# EAGLE design Arduino1 (EAGLE 6.6.0)
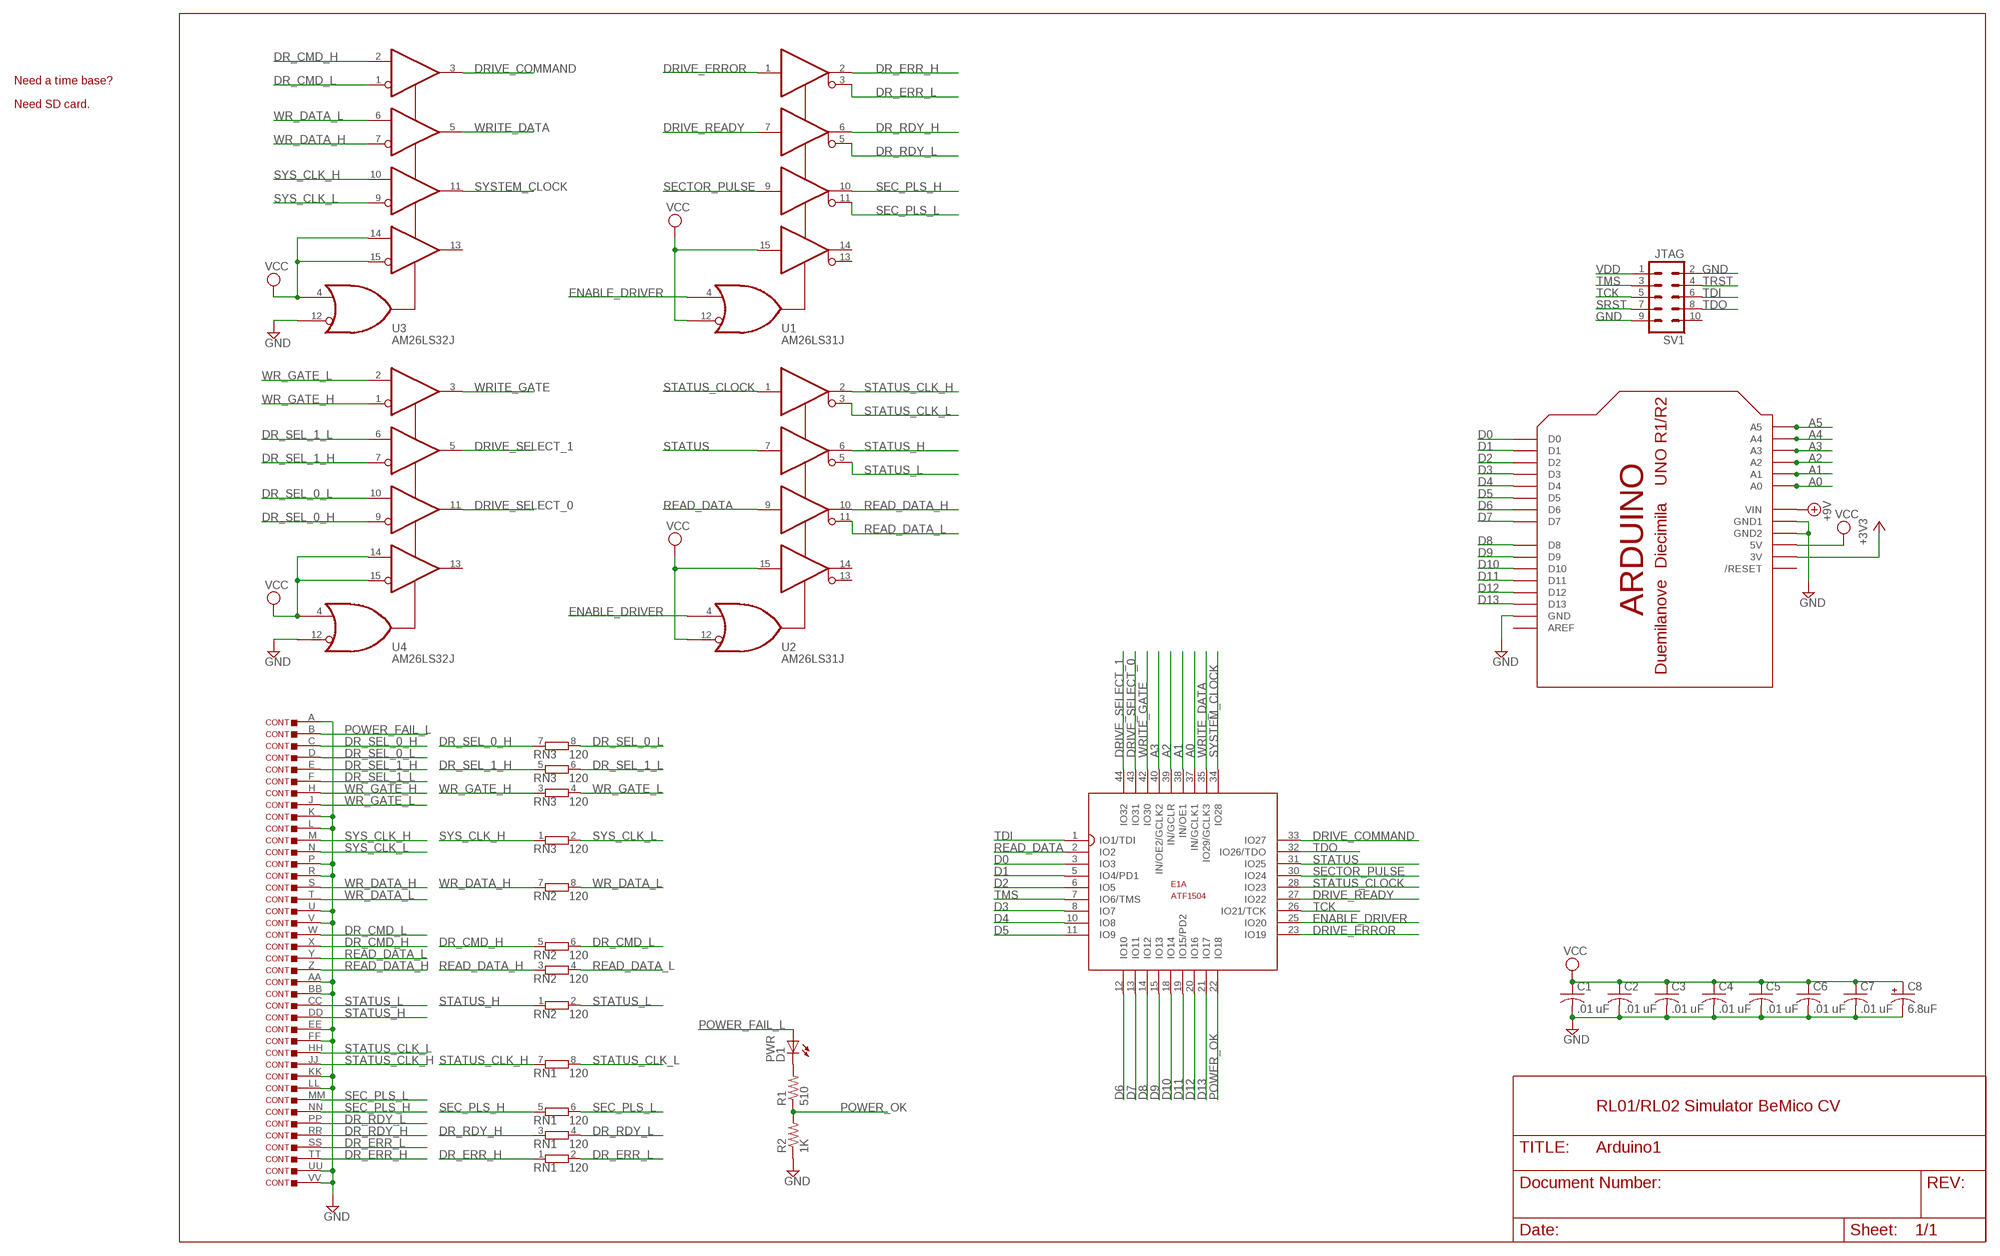
[diagram p0: schematic, sheet 1]

## Parts
C1  .01 uF  C-US050-025X075  [C050-025X075]
C2  .01 uF  C-US050-025X075  [C050-025X075]
C3  .01 uF  C-US050-025X075  [C050-025X075]
C4  .01 uF  C-US050-025X075  [C050-025X075]
C5  .01 uF  C-US050-025X075  [C050-025X075]
C6  .01 uF  C-US050-025X075  [C050-025X075]
C7  .01 uF  C-US050-025X075  [C050-025X075]
C8  6.8uF  CPOL-USE5-5  [E5-5]
CONT  DEC40PINSV  [DEC40PINV]
D1  PWR  LED5MM  [LED5MM]
E1  ATF1504  ATF150X44TQFP  [TQFP44]
R1  510  R-US_0207/10  [0207/10]
R2  1K  R-US_0207/10  [0207/10]
RN1  120  E4RP  [SIL8]
RN2  120  E4RP  [SIL8]
RN3  120  E4RP  [SIL8]
SV1  JTAG  ML10  [ML10]
U1  AM26LS31J  [SO16]
U2  AM26LS31J  [SO16]
U3  AM26LS32J  [SO16]
U4  AM26LS32J  [SO16]
U$3  ARDUINOUNO  [ARDUINO]

## Nets
+3V3: U$3.3V
+9V: U$3.VIN
A0: E1.37(A:IN/GCLK1) U$3.A0
A1: E1.38(A:IN/OE1) U$3.A1
A2: E1.39(A:IN/GCLR) U$3.A2
A3: E1.40(A:IN/OE2/GCLK2) U$3.A3
A4: U$3.A4
A5: U$3.A5
D0: E1.3(A:IO3) U$3.D0
D1: E1.5(A:IO4/PD1) U$3.D1
D2: E1.6(A:IO5) U$3.D2
D3: E1.8(A:IO7) U$3.D3
D4: E1.10(A:IO8) U$3.D4
D5: E1.11(A:IO9) U$3.D5
D6: E1.12(A:IO10) U$3.D6
D7: E1.13(A:IO11) U$3.D7
D8: E1.14(A:IO12) U$3.D8
D9: E1.15(A:IO13) U$3.D9
D10: E1.18(A:IO14) U$3.D10
D11: E1.19(A:IO15/PD2) U$3.D11
D12: E1.20(A:IO16) U$3.D12
D13: E1.21(A:IO17) U$3.D13
DR_CMD_H: CONT.X RN2.5 U3.2(P1)
DR_CMD_L: CONT.W RN2.6 U3.1(N1)
DR_ERR_H: CONT.TT RN1.1 U1.2(Y1)
DR_ERR_L: CONT.SS RN1.2 U1.3(Z1)
DR_RDY_H: CONT.RR RN1.3 U1.6(Y2)
DR_RDY_L: CONT.PP RN1.4 U1.5(Z2)
DR_SEL_0_H: CONT.C RN3.7 U4.9(N3)
DR_SEL_0_L: CONT.D RN3.8 U4.10(P3)
DR_SEL_1_H: CONT.E RN3.5 U4.7(N2)
DR_SEL_1_L: CONT.F RN3.6 U4.6(P2)
DRIVE_COMMAND: E1.33(A:IO27) U3.3(Y1)
DRIVE_ERROR: E1.23(A:IO19) U1.1(A1)
DRIVE_READY: E1.27(A:IO22) U1.7(A2)
DRIVE_SELECT_0: E1.43(A:IO31) U4.11(Y3)
DRIVE_SELECT_1: E1.44(A:IO32) U4.5(Y2)
ENABLE_DRIVER: E1.25(A:IO20) U1.4(G) U2.4(G)
GND [supply]: C1.2 C2.2 C3.2 C4.2 C5.2 C6.2 C7.2 C8.- CONT.A CONT.AA CONT.BB CONT.EE CONT.FF CONT.K CONT.KK CONT.L CONT.LL CONT.P CONT.R CONT.U CONT.UU CONT.V CONT.VV R2.1 SV1.2 SV1.9 U3.12(!G) U4.12(!G) U$3.GND U$3.GND1 U$3.GND2
N$1: D1.K(C) R1.2
N$2: U$3.AREF
N$9: U$3.RESET(/RESET)
POWER_FAIL_L: CONT.B D1.A
POWER_OK: E1.22(A:IO18) R1.1 R2.2
READ_DATA: E1.2(A:IO2) U2.9(A3)
READ_DATA_H: CONT.Z RN2.3 U2.10(Y3)
READ_DATA_L: CONT.Y RN2.4 U2.11(Z3)
SEC_PLS_H: CONT.NN RN1.5 U1.10(Y3)
SEC_PLS_L: CONT.MM RN1.6 U1.11(Z3)
SECTOR_PULSE: E1.30(A:IO24) U1.9(A3)
SRST: SV1.7
STATUS: E1.31(A:IO25) U2.7(A2)
STATUS_CLK_H: CONT.JJ RN1.7 U2.2(Y1)
STATUS_CLK_L: CONT.HH RN1.8 U2.3(Z1)
STATUS_CLOCK: E1.28(A:IO23) U2.1(A1)
STATUS_H: CONT.DD RN2.1 U2.6(Y2)
STATUS_L: CONT.CC RN2.2 U2.5(Z2)
SYS_CLK_H: CONT.M RN3.1 U3.10(P3)
SYS_CLK_L: CONT.N RN3.2 U3.9(N3)
SYSTEM_CLOCK: E1.34(A:IO28) U3.11(Y3)
TCK: E1.26(A:IO21/TCK) SV1.5
TDI: E1.1(A:IO1/TDI) SV1.6
TDO: E1.32(A:IO26/TDO) SV1.8
TMS: E1.7(A:IO6/TMS) SV1.3
TRST: SV1.4
VCC [supply]: C1.1 C2.1 C3.1 C4.1 C5.1 C6.1 C7.1 C8.+ U1.12(!G) U1.15(A4) U2.12(!G) U2.15(A4) U3.4(G) U3.14(P4) U3.15(N4) U4.4(G) U4.14(P4) U4.15(N4) U$3.5V
VDD: SV1.1
WR_DATA_H: CONT.S RN2.7 U3.7(N2)
WR_DATA_L: CONT.T RN2.8 U3.6(P2)
WR_GATE_H: CONT.H RN3.3 U4.1(N1)
WR_GATE_L: CONT.J RN3.4 U4.2(P1)
WRITE_DATA: E1.35(A:IO29/GCLK3) U3.5(Y2)
WRITE_GATE: E1.42(A:IO30) U4.3(Y1)
Unconnected: SV1.10 U1.13(Z4) U1.14(Y4) U2.13(Z4) U2.14(Y4) U3.13(Y4) U4.13(Y4)

## Notes on the sheet
- Need a time base?
- Need SD card.
- RL01/RL02 Simulator BeMico CV

## Power pins joined to a net without a drawn wire
GND: E1.4(GND) E1.16(GND) E1.24(GND) E1.36(GND) U1.8(GND) U2.8(GND) U3.8(GND) U4.8(GND)
VCC: E1.9(VCC) E1.17(VCC) E1.29(VCC) E1.41(VCC) U1.16(VCC) U2.16(VCC) U3.16(VCC) U4.16(VCC)

## Library data of the parts
C1-C7 = rcl:C-US: CAPACITOR, American symbol
C8 = rcl:CPOL-US: POLARIZED CAPACITOR, American symbol
CONT = dec-con:DEC40PINS: 40 pin ribbon connector for BC08, BC11 cables.
D1 = led:LED: LED OSRAM: - CHIPLED LG R971, LG N971, LY N971, LG Q971, LY Q971, LO R971, LY R971 LH N974, LH R974 LS Q976, LO Q976, LY Q976 LO Q996 - Hyper CHIPLED LW Q18S LB Q993, LB Q99A, LB R99A - SideLED LS A670, LO A670, LY A670, LG A670, LP A670 LB A673, LV A673, LT A673, LW A673 LH A674 LY A675 LS A676, LA A676, LO A676, LY A676, LW A676 LS A679, LY A679, LG A679 - Hyper Micro SIDELED® LS Y876, LA Y876, LO Y876, LY Y876 LT Y87S - SmartLED LW L88C, LW L88S LB L89C, LB L89S, LG L890 LS L89K, LO L89K, LY L89K LS L896, LA L896, LO L896, LY L896 - TOPLED LS T670, LO T670, LY T670, LG T670, LP T670 LSG T670, LSP T670, LSY T670, LOP T670, LYG T670 LG T671, LOG T671, LSG T671 LB T673, LV T673, LT T673, LW T673 LH T674 LS T676, LA T676, LO T676, LY T676, LB T676, LH T676, LSB T676, LW T676 LB T67C, LV T67C, LT T67C, LS T67K, LO T67K, LY T67K, LW E67C LS E67B, LA E67B, LO E67B, LY E67B, LB E67C, LV E67C, LT E67C LW T67C LS T679, LY T679, LG T679 LS T770, LO T770, LY T770, LG T770, LP T770 LB T773, LV T773, LT T773, LW T773 LH T774 LS E675, LA E675, LY E675, LS T675 LS T776, LA T776, LO T776, LY T776, LB T776 LHGB T686 LT T68C, LB T68C - Hyper Mini TOPLED® LB M676 - Mini TOPLED Santana® LG M470 LS M47K, LO M47K, LY M47K Source: http://www.osram.convergy.de LUXEON: - LUMILED® LXK2-PW12-R00, LXK2-PW12-S00, LXK2-PW14-U00, LXK2-PW14-V00 LXK2-PM12-R00, LXK2-PM12-S00, LXK2-PM14-U00 LXK2-PE12-Q00, LXK2-PE12-R00, LXK2-PE12-S00, LXK2-PE14-T00, LXK2-PE14-U00 LXK2-PB12-K00, LXK2-PB12-L00, LXK2-PB12-M00, LXK2-PB14-N00, LXK2-PB14-P00, LXK2-PB14-Q00 LXK2-PR12-L00, LXK2-PR12-M00, LXK2-PR14-Q00, LXK2-PR14-R00 LXK2-PD12-Q00, LXK2-PD12-R00, LXK2-PD12-S00 LXK2-PH12-R00, LXK2-PH12-S00 LXK2-PL12-P00, LXK2-PL12-Q00, LXK2-PL12-R00 Source: www.luxeon.com KINGBRIGHT: KA-3528ASYC Source: www.kingbright.com
E1 = atmel-cpld:ATF150X44: ATF150x in 44 pin packages
R1 R2 = rcl:R-US_: RESISTOR, American symbol
RN1-RN3 = resistor-sil:E4RP: SIL RESISTOR; OC_FARNELL: unknown; OC_NEWARK: unknown
SV1 = con-ml:ML10: HARTING; OC_FARNELL: unknown; OC_NEWARK: unknown
U1 U2 = dec-con:AM26LS31: Quad RS-422 Driver
U3 U4 = dec-con:AM26LS32: Quad Differential Reciever
U$3 = arduino:ARDUINO: Arduino Diecimila/Duemilanove Make a shield with ease, this package has all the named pins as well as the two mounting drill holes and an outline of the USB and DC power connector. The outline is on the DIMENSION layer, so if your board house uses it they will cut the outline to match. http://www.ladyada.net/library/pcb/eaglelibrary.html

## Net classes
1 supply: width 0.508 mm

## Board
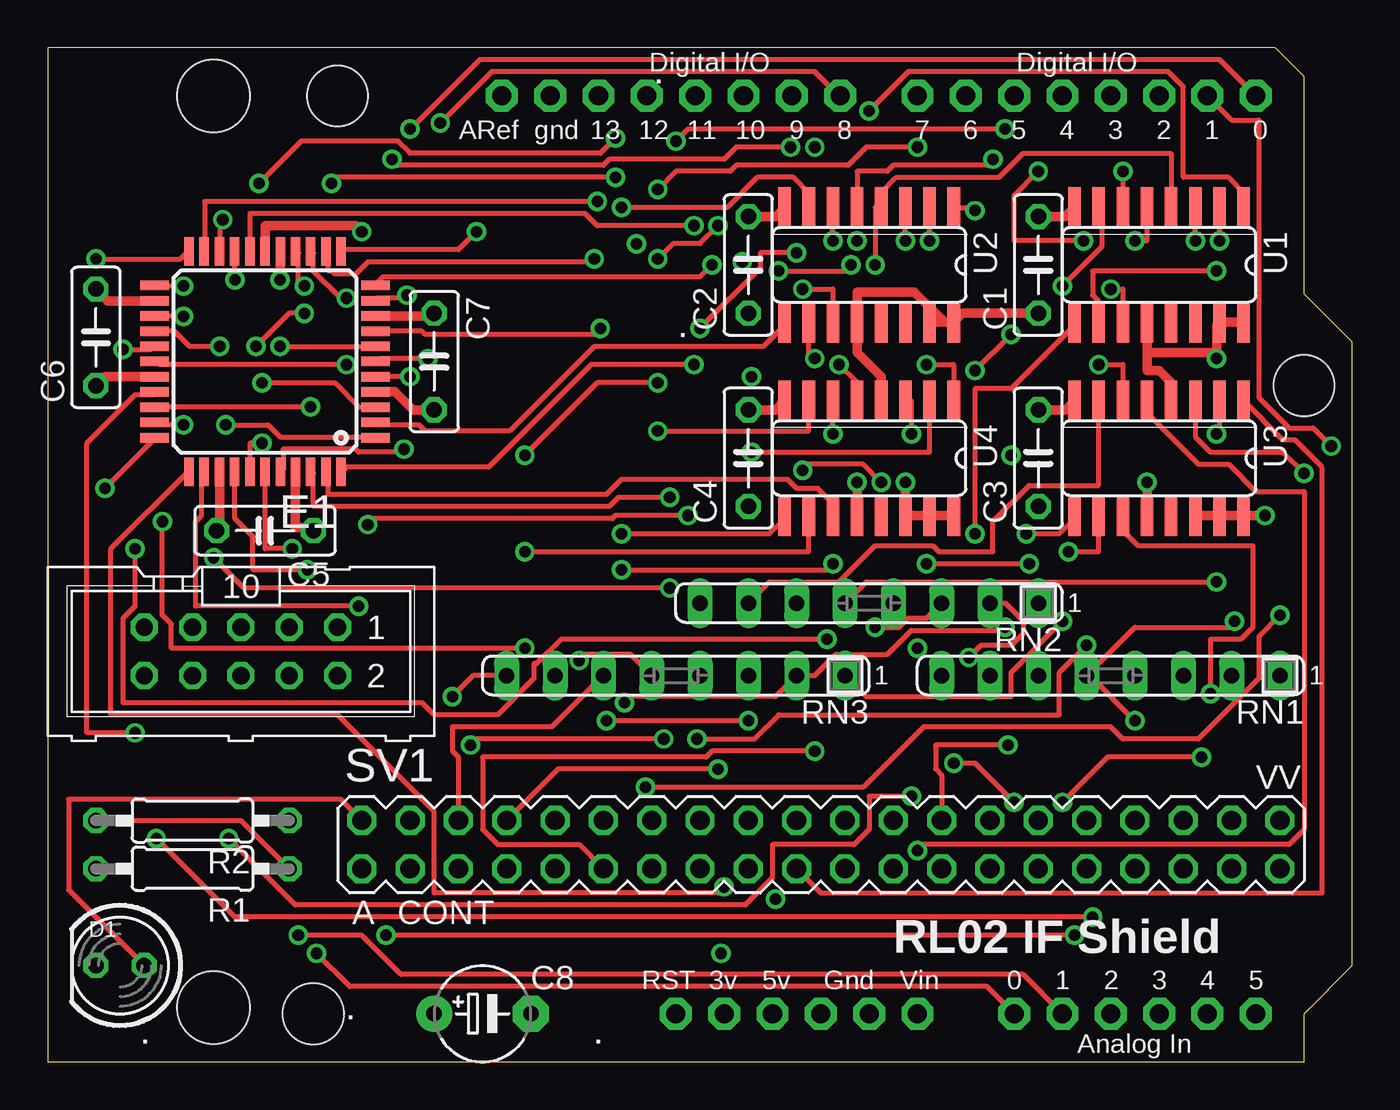
[diagram p1: board, top side]
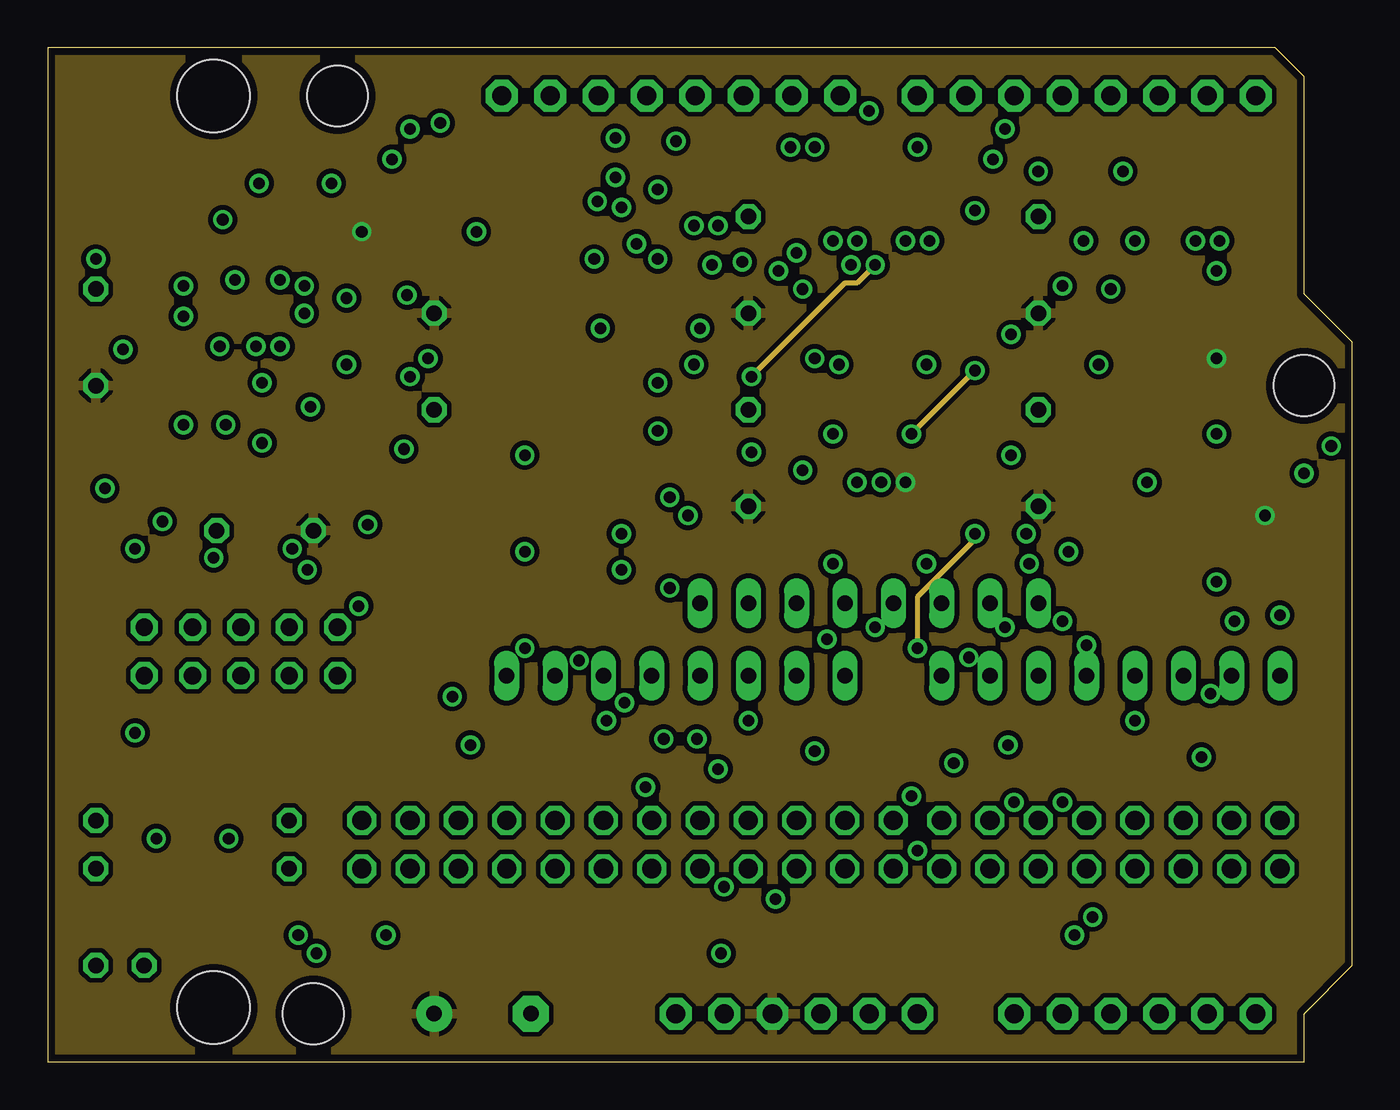
[diagram p2: board, inner layer $VCC]
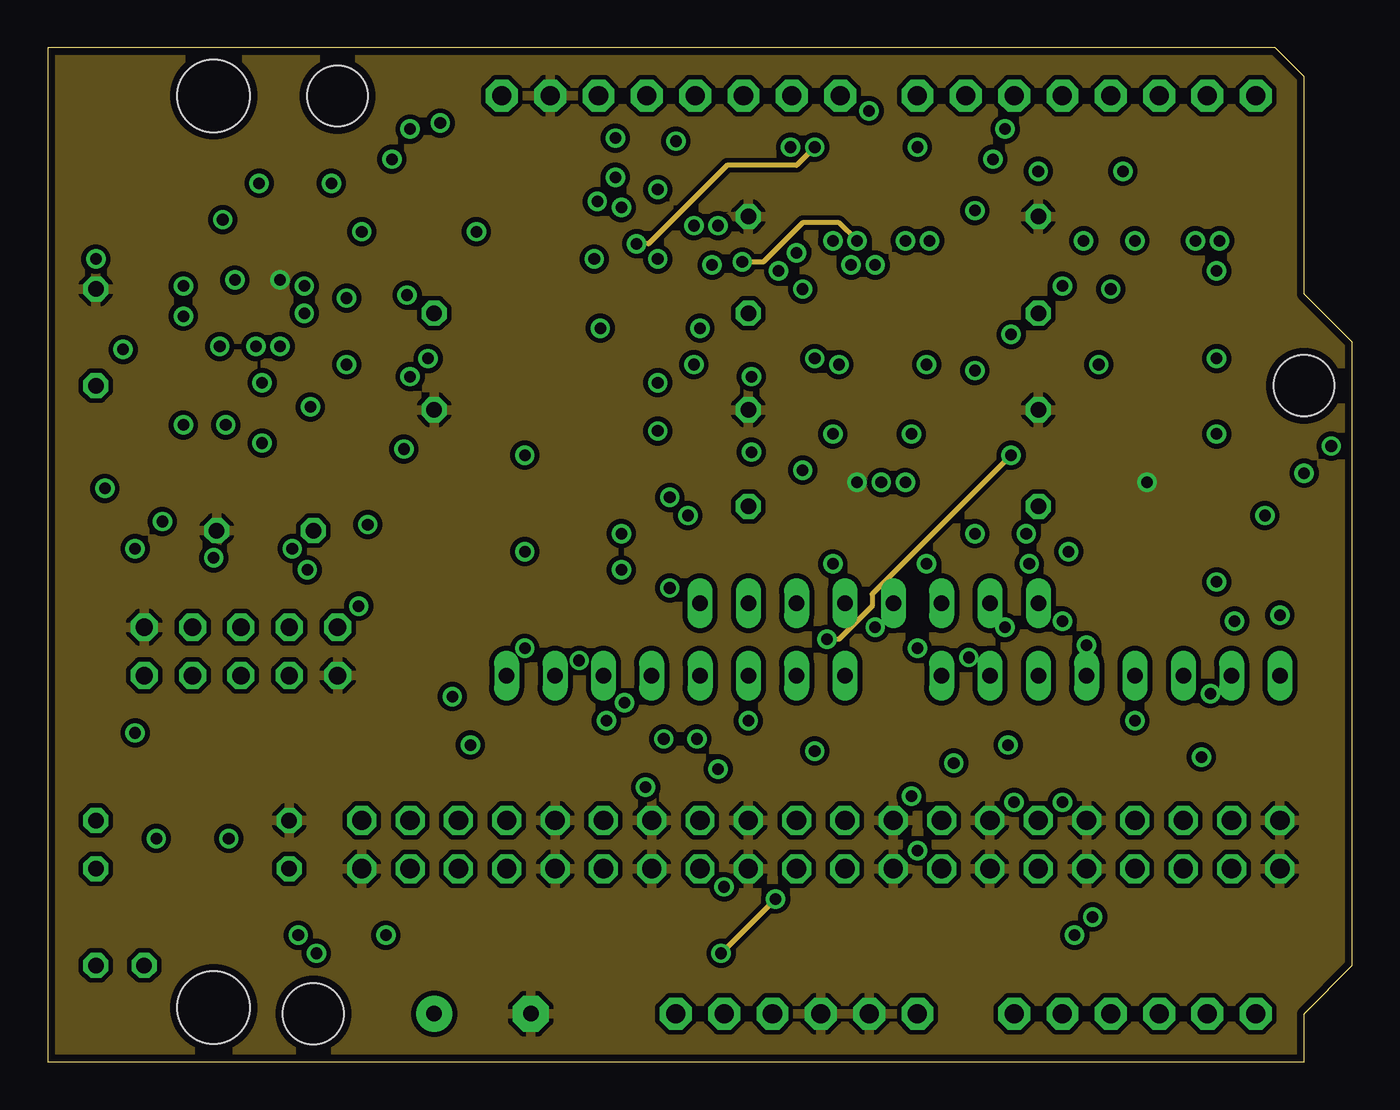
[diagram p3: board, inner layer $GND]
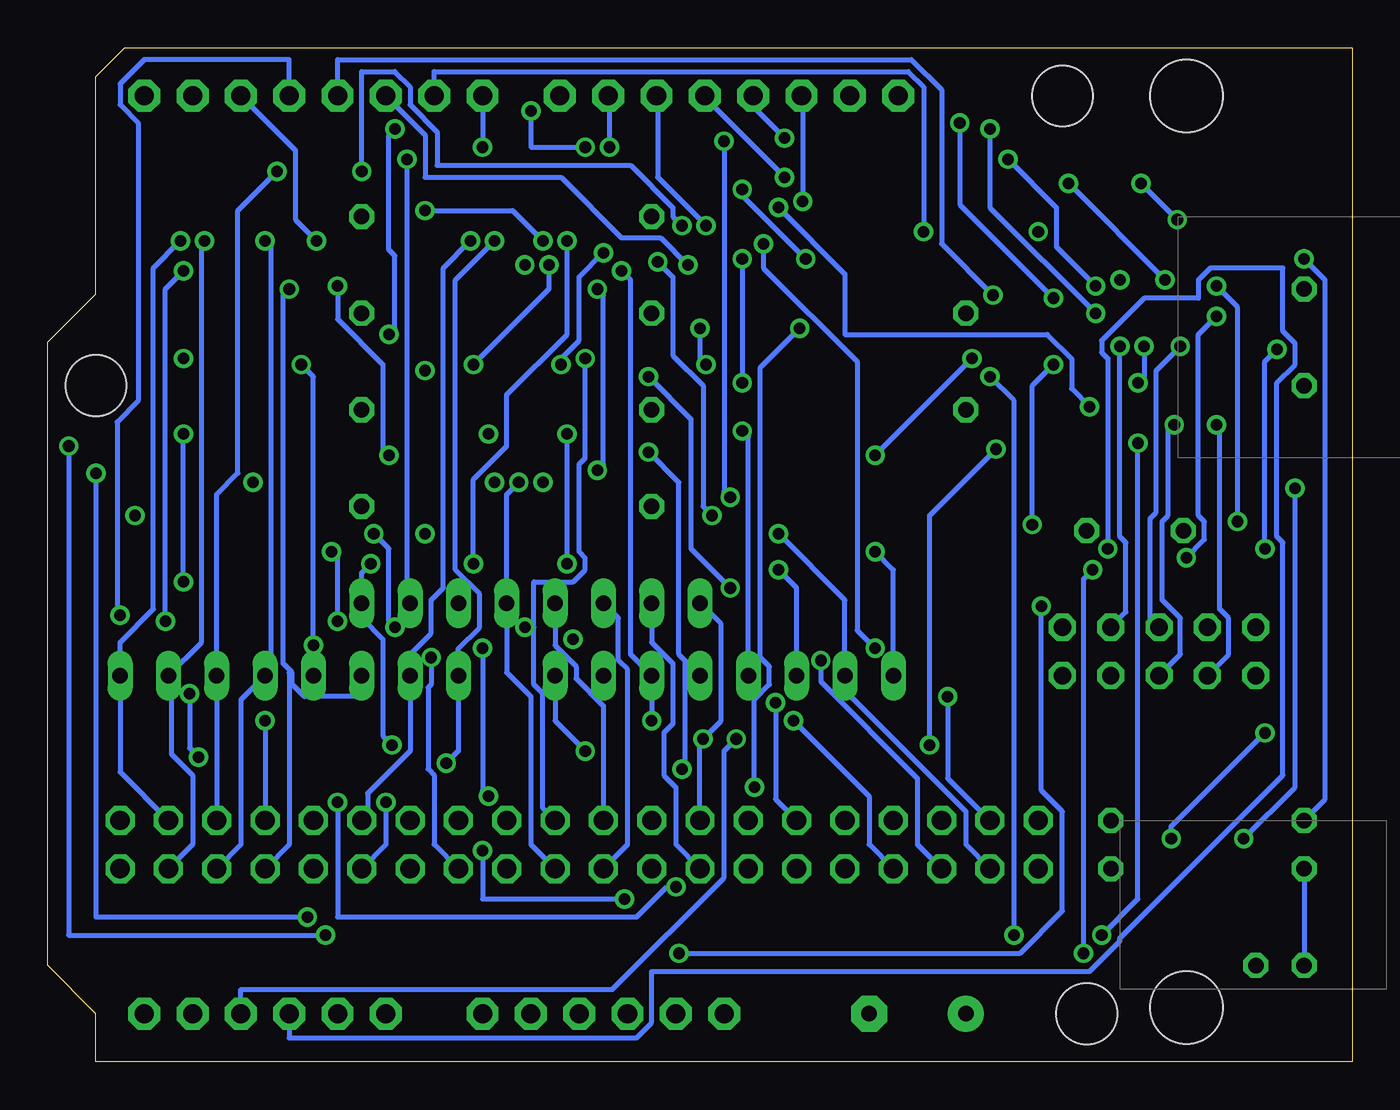
[diagram p4: board, bottom side, seen from below]

Size 68.58 x 53.34 mm. Coordinates in mm from the lower left corner, seen from the top.
Copper layers (1*2*15*16): Top 0.035mm / dielectric 1.5mm / $VCC 0.035mm / dielectric 0.15mm / $GND 0.035mm / dielectric 0.2mm / Bottom 0.035mm
Design rules "10mils *": minimum track width 10mil, minimum drill 24mil, track to track 10mil, track to pad 10mil, pad to pad 10mil, via to via 10mil, smd to smd 0mil, copper to edge 15mil, drill to drill 10mil, minimum pad ring 10mil, minimum via ring 8mil, stop-mask expansion 0mil, vias tented up to drill 0mil, thermal gap 10mil
Holes 3.81 mm at 8.73,50.8 8.73,2.86

### Footprints (pad centres in the part's own frame; a part is rotated, then mirrored left to right if it is on the bottom)
C050-025X075 = drill 0.813 octagon: 1 -2.54,0; 2 2.54,0
E5-5 = drill 0.813 pad 1.905: + -2.54,0 | drill 0.813 pad 1.905 octagon: - 2.54,0
DEC40PINV = drill 1.016 octagon: A -24.13,-1.27; AA 3.81,-1.27; B -24.13,1.27; BB 3.81,1.27; C -21.59,-1.27; CC 6.35,-1.27; D -21.59,1.27; DD 6.35,1.27; E -19.05,-1.27; EE 8.89,-1.27; F -19.05,1.27; FF 8.89,1.27; H -16.51,-1.27; HH 11.43,-1.27; J -16.51,1.27; JJ 11.43,1.27; K -13.97,-1.27; KK 13.97,-1.27; L -13.97,1.27; LL 13.97,1.27; M -11.43,-1.27; MM 16.51,-1.27; N -11.43,1.27; NN 16.51,1.27; P -8.89,-1.27; PP 19.05,-1.27; R -8.89,1.27; RR 19.05,1.27; S -6.35,-1.27; SS 21.59,-1.27; T -6.35,1.27; TT 21.59,1.27; U -3.81,-1.27; UU 24.13,-1.27; V -3.81,1.27; VV 24.13,1.27; W -1.27,-1.27; X -1.27,1.27; Y 1.27,-1.27; Z 1.27,1.27
LED5MM = drill 0.813 octagon: A -1.27,0; K 1.27,0
TQFP44 = smd 1.5 x 0.5: 1 -5.8,4; 2 -5.8,3.2; 3 -5.8,2.4; 4 -5.8,1.6; 5 -5.8,0.8; 6 -5.8,0; 7 -5.8,-0.8; 8 -5.8,-1.6; 9 -5.8,-2.4; 10 -5.8,-3.2; 11 -5.8,-4; 23 5.8,-4; 24 5.8,-3.2; 25 5.8,-2.4; 26 5.8,-1.6; 27 5.8,-0.8; 28 5.8,0; 29 5.8,0.8; 30 5.8,1.6; 31 5.8,2.4; 32 5.8,3.2; 33 5.8,4 | smd 0.5 x 1.5: 12 -4,-5.8; 13 -3.2,-5.8; 14 -2.4,-5.8; 15 -1.6,-5.8; 16 -0.8,-5.8; 17 0,-5.8; 18 0.8,-5.8; 19 1.6,-5.8; 20 2.4,-5.8; 21 3.2,-5.8; 22 4,-5.8; 34 4,5.8; 35 3.2,5.8; 36 2.4,5.8; 37 1.6,5.8; 38 0.8,5.8; 39 0,5.8; 40 -0.8,5.8; 41 -1.6,5.8; 42 -2.4,5.8; 43 -3.2,5.8; 44 -4,5.8
0207/10 = drill 0.813 octagon: 1 -5.08,0; 2 5.08,0
SIL8 = drill 0.813 long: 1 -8.89,0; 2 -6.35,0; 3 -3.81,0; 4 -1.27,0; 5 1.27,0; 6 3.81,0; 7 6.35,0; 8 8.89,0
ML10 = drill 0.914 octagon: 1 -5.08,-1.27; 2 -5.08,1.27; 3 -2.54,-1.27; 4 -2.54,1.27; 5 0,-1.27; 6 0,1.27; 7 2.54,-1.27; 8 2.54,1.27; 9 5.08,-1.27; 10 5.08,1.27
SO16 = smd 0.66 x 2.032: 1 -4.445,-3.073; 2 -3.175,-3.073; 3 -1.905,-3.073; 4 -0.635,-3.073; 5 0.635,-3.073; 6 1.905,-3.073; 7 3.175,-3.073; 8 4.445,-3.073; 9 4.445,3.073; 10 3.175,3.073; 11 1.905,3.073; 12 0.635,3.073; 13 -0.635,3.073; 14 -1.905,3.073; 15 -3.175,3.073; 16 -4.445,3.073
ARDUINO = drill 1 pad 1.676 octagon: 3V 35.56,2.54; 5V 38.1,2.54; A0 50.8,2.54; A1 53.34,2.54; A2 55.88,2.54; A3 58.42,2.54; A4 60.96,2.54; A5 63.5,2.54; AREF 23.876,50.8; D0 63.5,50.8; D1 60.96,50.8; D2 58.42,50.8; D3 55.88,50.8; D4 53.34,50.8; D5 50.8,50.8; D6 48.26,50.8; D7 45.72,50.8; D8 41.656,50.8; D9 39.116,50.8; D10 36.576,50.8; D11 34.036,50.8; D12 31.496,50.8; D13 28.956,50.8; GND 26.416,50.8; GND1 43.18,2.54; GND2 40.64,2.54; RESET 33.02,2.54; VIN 45.72,2.54 | hole 3.2: 15.24,50.8; 66.04,35.56; 13.97,2.54

### Placement (x,y rotation side)
C1  52.07,41.91 90 top
C2  36.83,41.91 90 top
C3  52.07,31.75 90 top
C4  36.83,31.75 90 top
C5  11.43,27.94 180 top
C6  2.54,38.1 90 top
C7  20.32,36.83 270 top
C8  22.86,2.54 0 top
CONT  40.64,11.43 0 top
D1  3.81,5.08 180 top
E1  11.43,36.83 180 top
R1  7.62,10.16 180 top
R2  7.62,12.7 180 top
RN1  55.88,20.32 180 top
RN2  43.18,24.13 180 top
RN3  33.02,20.32 180 top
SV1  10.16,21.59 180 top
U1  58.42,41.91 180 top
U2  43.18,41.91 180 top
U3  58.42,31.75 180 top
U4  43.18,31.75 180 top
U$3  0,0 0 top

### Tracks (layer width: path | path; a pad name or v marks a point on that pad's centre or on a via)
A0  (via drill 0.61)
  Top 0.254: v13.65,25.88 10.79,25.88 10.79,27.62 9.84,28.57 9.84,30.96 E1.37 | v14.13,5.71 15.88,3.97 49.37,3.97 U$3.A0
  Bottom 0.254: v13.65,25.88 14.13,25.4 v14.13,5.71
A1  (via drill 0.61)
  Top 0.254: v11.27,32.54 10.64,32.54 10.64,31.11 E1.38 | v13.18,6.67 16.51,6.67 18.57,4.6 51.28,4.6 U$3.A1
  Bottom 0.254: v11.27,32.54 11.27,8.57 v13.18,6.67
A2  (via drill 0.61)
  Top 0.254: E1.39 11.43,26.99 v12.86,26.99
  Bottom 0.254: v12.86,26.99 12.86,36.99 13.18,37.31 13.18,37.94 10.95,40.16 8.1,40.16 8.1,41.12 7.46,41.75 3.65,41.75 3.65,38.42 3.02,37.78 3.02,36.67 3.97,35.72 3.97,27.62 3.65,27.3 3.65,15.08 12.22,6.51 12.22,6.35 13.81,4.76 36.83,4.76 36.83,2.06 37.62,1.27 55.88,1.27 U$3.A2
A3  (via drill 0.61)
  Top 0.254: v18.73,32.23 18.57,32.07 16.35,32.07 16.19,32.23 12.38,32.23 12.38,31.11 E1.40 | v22.23,16.67 22.54,16.99 v32.38,16.99
  Bottom 0.254: v18.73,32.23 22.23,28.73 v22.23,16.67 | v32.38,16.99 33.02,16.35 33.02,9.68 38.89,3.81 58.42,3.81 U$3.A3
D0  (via drill 0.61)
  Top 0.254: v11.27,35.72 15.08,35.72 16.35,34.45 17.14,34.45 E1.3 | v10.95,37.62 12.7,39.37 v13.49,39.37 | v19.05,49.05 22.7,52.7 61.59,52.7 U$3.D0
  Bottom 0.254: v11.27,35.72 10.95,36.04 v10.95,37.62 | v13.49,39.37 19.05,44.93 v19.05,49.05
D1  (via drill 0.61)
  Top 0.254: v19.05,36.04 17.3,36.04 E1.5 | v53.98,6.67 v17.78,6.67 | v67.47,32.38 66.52,33.34 65.25,33.34 63.66,34.92 63.66,49.53 62.23,49.53 U$3.D1
  Bottom 0.254: v19.05,36.04 17.78,34.77 v17.78,6.67 | v53.98,6.67 67.47,6.67 v67.47,32.38
D2  (via drill 0.61)
  Top 0.254: v20,36.99 17.46,36.99 17.3,36.83 E1.6 | v25.08,31.91 28.89,35.72 v32.07,35.72 | v32.07,42.23 32.86,43.02 34.29,43.02 v35.24,43.97 | v52.07,46.83 50.8,45.56 50.8,43.18 v54.45,43.18
  Bottom 0.254: v25.08,31.91 v20,36.99 | v32.07,42.23 v32.07,35.72 | v35.24,43.97 35.72,44.45 35.72,44.93 37.94,47.15 48.1,47.15 48.1,48.9 49.53,50.32 49.53,51.28 50.32,52.07 52.07,52.07 v52.07,46.83 | v54.45,43.18 55.56,44.29 55.56,47.94 U$3.D2
D3  (via drill 0.61)
  Top 0.254: v29.05,38.58 28.73,38.26 19.84,38.26 19.68,38.42 17.3,38.42 E1.8 | v31.43,14.45 42.86,14.45 46.04,17.62 55.88,17.62 56.52,16.99 60.48,16.99 63.66,20.16 63.66,22.38 v64.77,23.5
  Bottom 0.254: v29.05,38.58 31.11,36.51 31.11,21.27 30.64,20.8 30.64,19.84 31.43,19.05 v31.43,14.45 | v64.77,23.5 64.93,23.65 64.93,33.66 63.82,34.77 63.82,49.37 64.77,50.32 64.77,51.44 63.5,52.7 55.88,52.7 U$3.D3
D4  (via drill 0.61)
  Top 0.254: v18.89,40.32 18.73,40.16 17.3,40.16 E1.10
  Bottom 0.254: v18.89,40.32 21.59,43.02 21.59,51.12 23.18,52.7 53.34,52.7 U$3.D4
D5  (via drill 0.61)
  Top 0.254: v34.92,41.91 34.29,41.27 17.62,41.27 17.3,40.96 E1.11
  Bottom 0.254: v34.92,41.91 36.35,43.34 38.42,43.34 41.59,46.51 48.74,46.51 48.74,48.74 U$3.D5
D6  (via drill 0.61)
  Top 0.254: v22.54,43.66 21.59,42.7 15.56,42.7 E1.12
  Bottom 0.254: v22.54,43.66 22.54,51.28 23.34,52.07 48.26,52.07 U$3.D6
D7  (via drill 0.61)
  Top 0.254: v28.73,42.23 28.57,42.07 16.83,42.07 16.19,41.43 15.08,41.43 14.92,41.59 14.76,41.59 14.76,42.55 E1.13 | v32.07,45.88 33.02,46.83 35.88,46.83 36.2,47.15 42.07,47.15 43.02,48.1 v45.72,48.1
  Bottom 0.254: v28.73,42.23 32.07,45.56 v32.07,45.88 | U$3.D7 v45.72,48.1
D8  (via drill 0.61)
  Top 0.254: v15.72,40.16 15.4,40.16 13.97,41.59 13.97,42.55 E1.14 | v20.64,49.37 23.34,52.07 40.32,52.07 41.59,50.8 U$3.D8
  Bottom 0.254: v15.72,40.16 20.64,45.09 v20.64,49.37
D9  (via drill 0.61)
  Top 0.254: v13.49,40.8 13.18,40.8 13.18,42.55 E1.15 | v18.1,47.47 18.41,47.15 29.21,47.15 29.53,47.47 35.56,47.47 36.2,48.1 v39.05,48.1
  Bottom 0.254: v13.49,40.8 15.56,42.86 15.56,44.93 v18.1,47.47 | v39.05,48.1 39.05,50.8 U$3.D9
D10  (via drill 0.61)
  Top 0.254: v33.97,43.97 28.89,43.97 28.26,44.61 10.64,44.61 10.64,42.7 E1.18
  Bottom 0.254: v33.97,43.97 36.51,46.51 36.51,50.8 U$3.D10
D11  (via drill 0.61)
  Top 0.254: v9.84,41.12 9.84,42.55 E1.19 | v14.92,46.2 15.24,46.51 v29.84,46.51
  Bottom 0.254: v14.92,46.2 v9.84,41.12 | v29.84,46.51 33.97,50.64 33.97,50.8 U$3.D11
D12  (via drill 0.61)
  Top 0.254: v9.21,44.29 9.05,44.29 9.05,42.7 E1.20 | v11.11,46.2 13.34,48.42 18.41,48.42 19.05,47.78 29.05,47.78 v29.84,48.58
  Bottom 0.254: v11.11,46.2 v9.21,44.29 | v29.84,48.58 31.43,50.16 31.43,50.8 U$3.D12
D13  (via drill 0.61)
  Top 0.254: v28.89,45.24 8.26,45.24 8.26,42.7 E1.21
  Bottom 0.254: v28.89,45.24 28.89,50.8 U$3.D13
DR_CMD_H  (via drill 0.61)
  Top 0.254: U3.2 61.59,33.02 v61.44,33.02 | v61.44,25.24 43.02,25.24 RN2.5
  Bottom 0.254: v61.44,25.24 v61.44,33.02 | CONT.X 39.37,18.73 40.8,20.16 40.8,20.8 41.91,21.91 RN2.5
DR_CMD_L
  Top 0.254: CONT.W 40.64,8.89 66.99,8.89 66.99,31.27 65.56,32.7 64.93,32.7 62.87,34.77 U3.1
  Bottom 0.254: RN2.6 38.58,23.34 38.58,21.11 38.1,20.64 38.1,11.43 CONT.W
DR_ERR_H  (via drill 0.61)
  Top 0.254: v61.59,43.18 U1.2
  Bottom 0.254: v61.59,43.18 63.02,41.75 63.02,23.81 64.77,22.07 RN1.1 64.77,15.24 CONT.TT
DR_ERR_L  (via drill 0.61)
  Top 0.254: v60.33,43.18 U1.3
  Bottom 0.254: v60.33,43.18 60.48,43.02 60.48,22.07 RN1.2 62.07,20.32 62.07,16.19 60.96,15.08 60.96,11.43 CONT.SS
DR_RDY_H  (via drill 0.61)
  Top 0.254: v56.52,46.83 U1.6
  Bottom 0.254: v56.52,46.83 58.58,44.77 58.58,30.96 59.69,29.84 RN1.3 CONT.RR
DR_RDY_L  (via drill 0.61)
  Top 0.254: U1.5 57.78,43.18 v57.15,43.18
  Bottom 0.254: v57.15,43.18 56.83,42.86 56.83,20.64 RN1.4 58.42,19.05 58.42,11.43 CONT.PP
DR_SEL_0_H  (via drill 0.61)
  Top 0.254: v30.16,27.78 37.94,27.78 38.73,28.57 U4.9
  Bottom 0.254: v30.16,27.78 26.67,24.29 RN3.7 26.67,19.53 20.32,13.18 20.32,11.43 CONT.C
DR_SEL_0_L  (via drill 0.61)
  Top 0.254: U4.10 40.01,26.83 v25.08,26.83 | v21.27,19.21 22.38,20.32 RN3.8
  Bottom 0.254: v25.08,26.83 24.13,25.88 RN3.8 | CONT.D 21.27,14.92 v21.27,19.21
DR_SEL_1_H  (via drill 0.61)
  Top 0.254: U4.7 40.01,33.18 v32.07,33.18 | v27.94,21.11 28.26,21.43 30.64,21.43 RN3.5
  Bottom 0.254: v32.07,33.18 31.75,32.86 RN3.5 | CONT.E 22.86,11.43 22.86,14.92 27.94,20 v27.94,21.11
DR_SEL_1_L  (via drill 0.61)
  Top 0.254: v41.27,33.02 U4.6 | v41.27,26.19 40.96,25.88 v30.16,25.88 | CONT.F 21.59,16.03 21.27,16.35 21.27,17.62 26.51,17.62 RN3.6
  Bottom 0.254: v41.27,26.19 v41.27,33.02 | v30.16,25.88 29.21,24.92 RN3.6
DRIVE_COMMAND  (via drill 0.61)
  Top 0.254: v3.02,30.16 5.56,32.7 E1.33 | v5.71,11.75 9.84,7.62 v54.93,7.62 | v66.04,30.96 64.93,32.07 61.12,32.07 60.33,32.86 U3.3
  Bottom 0.254: v3.02,30.16 3.02,14.45 v5.71,11.75 | v54.93,7.62 66.04,7.62 v66.04,30.96
DRIVE_ERROR  (via drill 0.61)
  Top 0.254: v7.14,40.8 5.71,40.8 E1.23 | v6.03,28.42 6.03,23.5 6.51,23.02 6.51,21.75 v25.08,21.75 | v43.18,50.01 45.24,52.07 58.9,52.07 59.69,51.28 59.69,46.51 62.07,46.51 62.87,45.72 U1.1
  $GND 0.254: v30.96,43.02 31.59,43.02 35.72,47.15 39.37,47.15 v40.32,48.1
  Bottom 0.254: v7.14,40.8 6.03,39.69 v6.03,28.42 | v25.08,21.75 26.04,22.7 26.04,36.83 30.96,41.75 v30.96,43.02 | v40.32,48.1 43.18,48.1 v43.18,50.01
DRIVE_READY  (via drill 0.61)
  Top 0.254: v3.97,37.47 5.4,37.47 5.56,37.62 E1.27 | v4.6,26.99 4.6,23.97 3.97,23.34 3.97,18.89 19.68,18.89 20.32,18.26 23.65,18.26 25.56,20.16 25.56,20.95 25.72,20.95 26.99,22.23 v40.96,22.23 | v53.34,40.8 55.4,42.86 55.4,44.93 55.24,44.93 U1.7
  $GND 0.254: v40.96,22.23 41.59,22.23 43.34,23.97 43.34,24.61 v50.64,31.91
  Bottom 0.254: v3.97,37.47 4.6,36.83 v4.6,26.99 | v50.64,31.91 50.96,32.23 50.96,36.67 53.34,39.05 v53.34,40.8
DRIVE_SELECT_0
  Top 0.254: U4.11 41.27,29.37 40.48,30.16 39.37,30.16 38.89,30.64 30.16,30.64 29.37,29.84 14.76,29.84 14.76,30.96 E1.43
DRIVE_SELECT_1  (via drill 0.61)
  Top 0.254: v33.97,36.67 28.57,36.67 23.18,31.27 15.72,31.27 15.56,31.11 E1.44 | v34.29,38.58 37.47,41.75 37.47,42.55 v39.37,42.55 | v41.59,36.67 42.55,35.72 U4.5
  Bottom 0.254: v33.97,36.67 34.29,36.99 v34.29,38.58 | v39.37,42.55 40.64,41.27 40.64,37.94 41.59,36.99 v41.59,36.67
ENABLE_DRIVER  (via drill 0.61)
  Top 0.254: v7.14,39.21 5.71,39.21 E1.25 | v8.73,26.51 10.32,24.92 v32.7,24.92 | v43.5,41.91 43.5,44.93 43.81,44.93 U2.4 43.81,45.72 44.61,46.51 50.01,46.51 51.28,47.78 59.05,47.78 U1.4
  $VCC 0.254: v36.99,36.04 41.91,40.96 42.55,40.96 v43.5,41.91
  Bottom 0.254: v7.14,39.21 8.1,38.26 8.1,28.73 7.78,28.42 7.78,27.46 v8.73,26.51 | v32.7,24.92 34.77,26.99 34.77,33.81 v36.99,36.04
GND  (via drill 0.61)
  Top 0.508: C5.2 9.05,27.94 9.05,30.96 E1.36 | C7.2 19.21,34.29 18.26,35.24 17.3,35.24 E1.4 | C6.2 3.17,40.01 5.56,40.01 E1.24 | v12.22,41.12 12.22,42.55 E1.16 | v42.55,30.48 U4.12 | C4.2 38.26,34.29 38.73,34.77 U4.8 | C2.2 38.26,44.45 38.73,44.93 U2.8 | v57.78,30.48 U3.12 | C3.2 53.5,34.29 53.98,34.77 U3.8 | C1.2 53.5,44.45 53.98,44.93 U1.8
  pour $GND: 0,0 66.04,0 66.04,2.54 68.58,5.08 68.58,38.1 66.04,40.64 66.04,52.07 64.77,53.34 0,53.34
N$1
  Bottom 0.254: R1.2 D1.K
POWER_FAIL_L
  Top 0.254: D1.A 1.11,9.05 1.11,13.81 15.4,13.81 CONT.B
POWER_OK  (via drill 0.61)
  Top 0.254: v2.54,42.23 6.99,42.23 7.3,42.55 E1.22 | R1.1 10.16,12.7 R2.2
  Bottom 0.254: v2.54,42.23 1.43,41.12 1.43,13.81 R2.2
READ_DATA
  Top 0.254: E1.2 17.3,33.5 19.53,33.5 19.84,33.18 24.29,33.18 28.73,37.62 37.62,37.62 38.73,38.73 U2.9
READ_DATA_H  (via drill 0.61)
  Top 0.254: U2.10 40.01,36.99 v40.32,36.99 | RN2.3 46.2,23.34 45.24,23.34 44.77,22.86 v43.5,22.86
  Bottom 0.254: v40.32,36.99 40.32,31.75 40.64,31.43 40.64,26.83 40.32,26.51 40.32,25.88 40.96,25.24 43.02,25.24 43.02,22.86 | 43.02,22.86 43.02,19.84 42.55,19.37 42.55,13.34 CONT.Z | 43.02,22.86 v43.5,22.86
READ_DATA_L  (via drill 0.61)
  Top 0.254: U2.11 41.27,40.64 v39.69,40.64 | v39.69,31.11 40.01,31.43 42.86,31.43 v43.81,30.48
  Bottom 0.254: v39.69,40.64 39.37,40.32 39.37,31.43 v39.69,31.11 | v43.81,30.48 44.45,29.84 RN2.4 44.45,20.48 43.18,19.21 43.18,11.43 CONT.Y
SEC_PLS_H  (via drill 0.61)
  Top 0.254: U1.10 55.24,40.01 54.93,40.32 54.93,41.59 v61.44,41.59 | v62.39,23.18 62.07,22.86 57.15,22.86 RN1.5 54.77,20.32 v57.15,17.94
  Bottom 0.254: v61.44,41.59 62.39,40.64 v62.39,23.18 | v57.15,17.94 CONT.NN
SEC_PLS_L  (via drill 0.61)
  Top 0.254: U1.11 56.52,40.64 v55.88,40.64
  Bottom 0.254: v55.88,40.64 56.2,40.32 56.2,20.95 55.8,20.56 | 55.8,20.56 55.72,20.48 55.72,19.84 55.09,19.21 52.07,19.21 RN1.6 | CONT.MM 55.88,11.43 55.88,20.48 55.8,20.56
SECTOR_PULSE  (via drill 0.61)
  Top 0.254: v4.6,17.3 2.06,17.3 2.06,32.54 4.6,35.08 5.56,35.08 E1.30 | v9.53,11.75 13.02,8.26 36.67,8.26 38.1,9.68 38.1,11.43 42.39,11.43 43.18,12.22 43.18,13.97 v45.4,13.97 | v48.74,27.78 48.74,35.4 50.64,35.4 53.98,38.73 U1.9
  $VCC 0.254: v45.72,21.75 45.72,24.45 48.74,27.46 v48.74,27.78
  Bottom 0.254: v4.6,17.3 9.53,12.38 v9.53,11.75 | v45.4,13.97 45.72,14.29 v45.72,21.75
STATUS  (via drill 0.61)
  Top 0.254: v13.81,34.45 5.71,34.45 E1.31 | v30.16,44.93 35.72,44.93 37.31,46.51 39.21,46.51 40.01,45.72 U2.7
  Bottom 0.254: v13.81,34.45 14.76,35.4 14.76,36.99 16.03,38.26 26.67,38.26 26.67,41.43 v30.16,44.93
STATUS_CLK_H  (via drill 0.61)
  Top 0.254: v46.35,43.18 U2.2
  Bottom 0.254: v46.35,43.18 47.78,41.75 47.78,24.92 48.42,24.29 48.42,22.54 49.53,21.43 RN1.7 49.53,16.35 51.75,14.13 51.75,13.02 CONT.JJ
STATUS_CLK_L  (via drill 0.61)
  Top 0.254: v45.09,43.18 U2.3 | v50.8,13.65 48.74,15.72 v47.62,15.72
  Bottom 0.254: v45.09,43.18 47.15,41.12 47.15,25.88 45.88,24.61 45.88,22.86 46.99,21.75 RN1.8 46.99,16.35 v47.62,15.72 | CONT.HH 50.8,11.43 v50.8,13.65
STATUS_CLOCK  (via drill 0.61)
  Top 0.254: v15.72,36.67 5.87,36.67 5.71,36.83 E1.28 | v16.83,28.26 17.14,28.57 29.69,28.57 29.84,28.73 v33.66,28.73 | v48.74,44.77 48.58,44.93 47.62,44.93 U2.1
  $GND 0.254: v36.51,42.07 37.62,42.07 39.69,44.13 41.59,44.13 v42.55,43.18
  Bottom 0.254: v15.72,36.67 16.83,35.56 v16.83,28.26 | v33.66,28.73 34.13,29.21 34.13,35.56 35.72,37.15 35.72,41.27 v36.51,42.07 | v42.55,43.18 44.13,44.77 v48.74,44.77
STATUS_H  (via drill 0.61)
  Top 0.254: v41.27,43.18 U2.6 | v51.59,26.19 v46.2,26.19 | CONT.DD 46.99,15.08 46.67,15.4 46.67,16.67 v50.48,16.67
  Bottom 0.254: v41.27,43.18 41.27,38.26 44.45,35.08 44.45,32.38 46.2,30.64 v46.2,26.19 | v51.59,26.19 52.07,25.72 RN2.1 52.07,23.34 50.96,22.23 50.96,17.14 v50.48,16.67
STATUS_L  (via drill 0.61)
  Top 0.254: U2.5 42.55,46.83 44.13,46.83 44.45,47.15 49.37,47.15 v49.69,47.47 | v48.42,21.27 49.05,21.91 50.64,21.91 51.28,22.54 51.28,23.34 51.12,23.34 50.32,24.13 RN2.2
  Bottom 0.254: v49.69,47.47 49.69,24.29 RN2.2 | CONT.CC 48.26,11.43 48.26,15.08 48.58,15.4 48.58,19.68 48.42,19.84 v48.42,21.27
SYS_CLK_H  (via drill 0.61)
  Top 0.254: U3.10 55.24,26.83 v53.66,26.83 | v53.34,23.18 50.64,20.48 50.64,19.21 43.02,19.21 RN3.1 | CONT.M 27.94,11.43 23.65,11.43 22.86,12.22 22.86,16.03 34.61,16.03 34.92,16.35 v40.32,16.35
  Bottom 0.254: v53.66,26.83 53.34,26.51 v53.34,23.18 | v40.32,16.35 41.91,17.94 RN3.1
SYS_CLK_L  (via drill 0.61)
  Top 0.254: v51.44,27.78 53.18,27.78 53.98,28.57 U3.9 | v50.32,22.86 50.16,22.7 45.4,22.7 44.13,21.43 41.43,21.43 40.32,20.32 RN3.2 38.26,19.21 30.64,19.21 v30.32,18.89
  Bottom 0.254: v51.44,27.78 50.64,26.99 50.64,23.18 v50.32,22.86 | CONT.N 30.32,13.81 v30.32,18.89
SYSTEM_CLOCK  (via drill 0.61)
  Top 0.254: v35.56,9.21 35.24,8.89 20.32,8.89 20.32,13.18 15.24,18.26 3.33,18.26 3.33,26.99 7.3,30.96 E1.34 | v53.34,13.65 55.72,16.03 v60.64,16.03 | v61.12,19.37 61.12,22.23 62.71,22.23 63.34,22.86 63.34,27.15 57.31,27.15 56.52,27.94 U3.11
  Bottom 0.254: v35.56,9.21 36.04,9.21 37.62,7.62 53.34,7.62 v53.34,13.65 | v60.64,16.03 61.12,16.51 v61.12,19.37
TCK  (via drill 0.61)
  Top 0.254: v9.05,37.62 7.46,37.62 6.67,38.42 5.71,38.42 E1.26
  Bottom 0.254: v9.05,37.62 10.32,36.35 10.32,28.89 10.64,28.57 10.64,23.34 SV1.5
TDI  (via drill 0.61)
  Top 0.254: v9.37,33.5 11.59,33.5 12.22,32.86 17.14,32.86 E1.1
  Bottom 0.254: v9.37,33.5 9.68,33.18 9.68,28.73 10,28.42 10,24.29 9.05,23.34 9.05,21.43 SV1.6
TDO  (via drill 0.61)
  Top 0.254: v7.14,33.5 5.71,33.5 E1.32
  Bottom 0.254: v7.14,33.5 6.99,33.34 6.99,23.81 6.51,23.34 6.51,21.43 SV1.8
TMS  (via drill 0.61)
  Top 0.254: v12.22,37.62 17.14,37.62 E1.7
  Bottom 0.254: v12.22,37.62 12.22,27.62 11.91,27.3 11.91,23.65 SV1.3
VCC  (via drill 0.61)
  Top 0.508: U1.16 62.87,38.89 61.59,38.89 U1.15 61.44,38.73 61.44,37.31 | 57.78,37.31 57.78,36.35 58.42,36.35 59.05,35.72 U3.4 | 57.78,37.31 U1.12 | 57.78,37.31 61.44,37.31 | U4.4 43.81,36.04 42.55,37.31 U2.12 42.55,40.48 45.56,40.48 46.99,39.05 46.99,38.89 | U3.14 60.33,28.73 61.59,28.73 U3.15 61.75,28.73 62.87,28.73 U3.16 63.02,28.73 v63.98,28.73 | U4.16 47.62,28.73 46.51,28.73 U4.15 46.35,28.73 45.09,28.73 U4.14 v45.09,30.48 | 46.99,38.89 47.62,38.89 U2.16 47.78,39.05 48.1,39.37 C1.1 | 46.99,38.89 46.35,38.89 U2.15 | C6.1 3.02,36.04 5.56,36.04 E1.29 | E1.17 11.43,43.97 16.19,43.97 v16.51,43.66 | C5.1 13.81,28.1 13.02,28.1 13.02,30.96 E1.41 | C7.1 20.16,39.21 17.3,39.21 E1.9 | v61.44,36.99 61.44,37.31
  pour $VCC: 0,0 66.04,0 66.04,2.54 68.58,5.08 68.58,38.1 66.04,40.64 66.04,52.07 64.77,53.34 0,53.34
WR_DATA_H
  Top 0.254: U3.7 55.24,30.32 51.59,30.32 49.69,28.42 49.69,26.83 46.83,26.83 46.51,27.15 43.5,27.15 41.59,25.24 37.94,25.24 RN2.7
  Bottom 0.254: CONT.S 35.56,11.43 35.56,14.45 36.2,15.08 36.2,17.3 35.72,17.78 35.72,20.95 36.83,22.07 RN2.7
WR_DATA_L  (via drill 0.61)
  Top 0.254: U3.6 56.52,36.67 v55.24,36.67 | v54.61,21.91 53.18,20.48 53.18,18.26 38.42,18.26 37.15,16.99 v34.13,16.99
  Bottom 0.254: v55.24,36.67 54.61,36.04 v54.61,21.91 | CONT.T 34.29,16.83 v34.13,16.99 33.18,17.94 33.18,23.02 RN2.8
WR_GATE_H  (via drill 0.61)
  Top 0.254: U4.1 47.62,36.67 v46.2,36.67 | v42.23,41.91 41.91,41.59 v38.42,41.59 | v36.83,17.94 v29.37,17.94
  Bottom 0.254: v46.2,36.67 42.23,40.64 v42.23,41.91 | v38.42,41.59 37.94,41.12 37.94,21.43 RN3.3 v36.83,17.94 | CONT.H 25.4,11.43 25.4,13.97 v29.37,17.94
WR_GATE_L  (via drill 0.61)
  Top 0.254: U4.2 46.35,32.07 v36.99,32.07 | CONT.J 26.83,15.4 v35.24,15.4
  Bottom 0.254: v36.99,32.07 35.4,30.48 35.4,21.43 35,21.03 | RN3.4 35,21.03 | v35.24,15.4 35.08,15.56 35.08,20.95 35,21.03
WRITE_DATA  (via drill 0.61)
  Top 0.254: v16.35,23.97 7.78,23.97 7.78,28.42 8.1,28.73 8.1,30.96 E1.35 | v45.72,11.11 46.04,11.43 65.25,11.43 66.04,12.22 66.04,30 63.5,30 62.07,31.43 60.48,31.43 57.78,34.13 U3.5
  $GND 0.254: v38.26,8.57 v35.4,5.71
  Bottom 0.254: v16.35,23.97 16.35,14.29 15.24,13.18 15.24,7.94 17.46,5.71 v35.4,5.71 | v38.26,8.57 45.72,8.57 v45.72,11.11
WRITE_GATE  (via drill 0.61)
  Top 0.254: v32.7,29.69 30,29.69 29.53,29.21 13.97,29.21 13.97,30.96 E1.42 | v33.02,48.42 33.66,49.05 v50.32,49.05 | v48.74,36.35 v50.64,38.26 | v45.4,33.02 45.4,34.77 45.09,34.77 U4.3
  $VCC 0.254: v45.4,33.02 v48.74,36.35
  Bottom 0.254: v32.7,29.69 33.02,30 v33.02,48.42 | v50.32,49.05 50.64,48.74 50.64,42.7 50.32,42.39 50.32,38.58 v50.64,38.26

### Text on the board
tNames: . | . | RL02 IF Shield | . | . | .